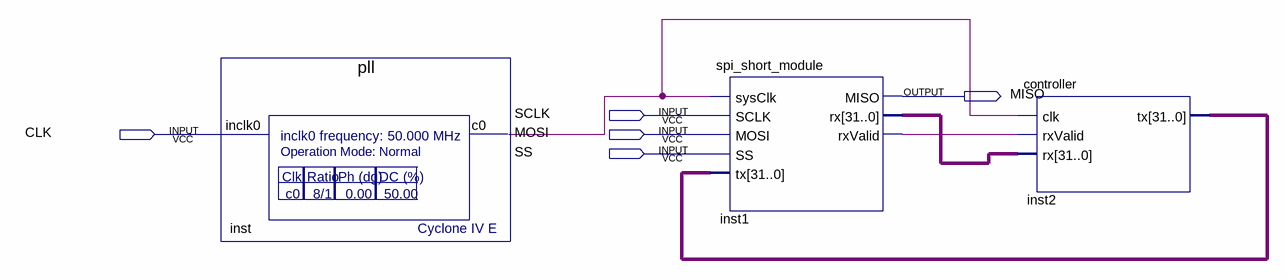
[diagram p0: schematic sheet]
// Quartus schematic test_clk500Mhz.bdf as structural Verilog: 3 symbols, 5 pins
module test_clk500Mhz (
  input  SCLK,
  input  CLK,
  input  MOSI,
  input  SS,
  output MISO
);

  wire inst1_rxvalid, inst_c0;
  wire [31:0] inst1_rx, inst2_tx;

  pll inst (.inclk0(CLK), .c0(inst_c0));
  spi_short_module inst1 (
    .sysClk(inst_c0), .SCLK(SCLK), .MOSI(MOSI), .SS(SS), .tx(inst2_tx), .MISO(MISO), .rx(inst1_rx),
    .rxValid(inst1_rxvalid));
  controller inst2 (.clk(inst_c0), .rxValid(inst1_rxvalid), .rx(inst1_rx), .tx(inst2_tx));
endmodule
